# EAGLE design arduino clock divider with logo (EAGLE 9.6.1)
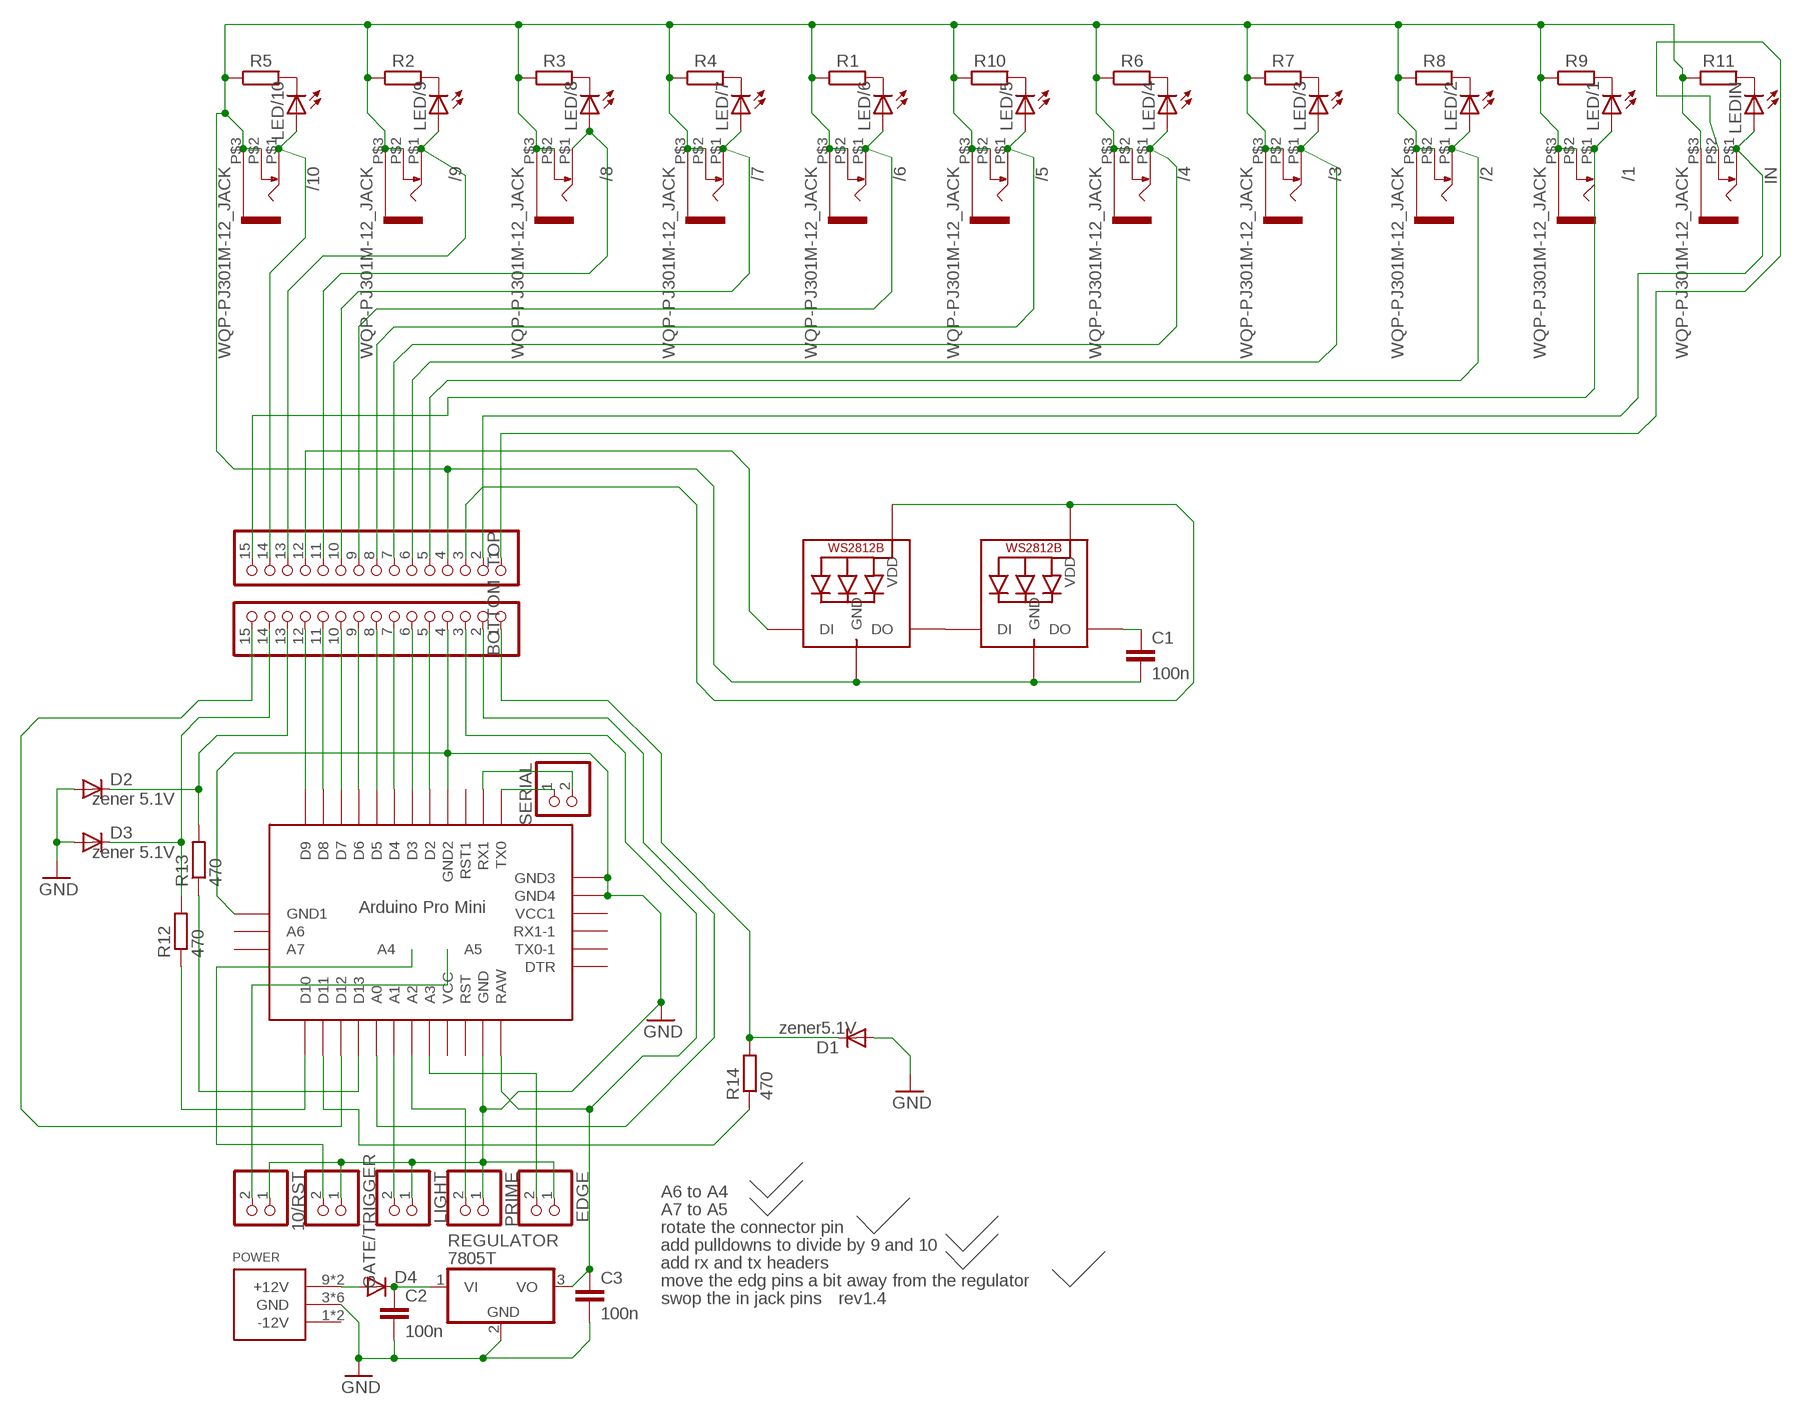
[diagram p0: schematic, sheet 1]

## Parts
10/RST  PINHD-1X2  [1X02]
/1  WQP-PJ301M-12_JACK  [WQP-PJ301M-12_JACK]
/2  WQP-PJ301M-12_JACK  [WQP-PJ301M-12_JACK]
/3  WQP-PJ301M-12_JACK  [WQP-PJ301M-12_JACK]
/4  WQP-PJ301M-12_JACK  [WQP-PJ301M-12_JACK]
/5  WQP-PJ301M-12_JACK  [WQP-PJ301M-12_JACK]
/6  WQP-PJ301M-12_JACK  [WQP-PJ301M-12_JACK]
/7  WQP-PJ301M-12_JACK  [WQP-PJ301M-12_JACK]
/8  WQP-PJ301M-12_JACK  [WQP-PJ301M-12_JACK]
/9  WQP-PJ301M-12_JACK  [WQP-PJ301M-12_JACK]
/10  WQP-PJ301M-12_JACK  [WQP-PJ301M-12_JACK]
BOTTOM  PINHD-1X15-CB  [1X15-CB3D]
C1  100n  C-EU025-025X050  [C025-025X050]
C2  100n  C-EU025-025X050  [C025-025X050]
C3  100n  C-EU025-025X050  [C025-025X050]
D1  zener5.1V  BAV21  [DO35-10]
D2  zener 5.1V  BAV21  [DO35-10]
D3  zener 5.1V  BAV21  [DO35-10]
D4  BAV21  [DO35-10]
EDGE  PINHD-1X2  [1X02]
GATE/TRIGGER  PINHD-1X2  [1X02]
IN  WQP-PJ301M-12_JACK  [WQP-PJ301M-12_JACK]
LED/1  LED3MM  [LED3MM]
LED/2  LED3MM  [LED3MM]
LED/3  LED3MM  [LED3MM]
LED/4  LED3MM  [LED3MM]
LED/5  LED3MM  [LED3MM]
LED/6  LED3MM  [LED3MM]
LED/7  LED3MM  [LED3MM]
LED/8  LED3MM  [LED3MM]
LED/9  LED3MM  [LED3MM]
LED/10  LED3MM  [LED3MM]
LEDIN  LED3MM  [LED3MM]
LIGHT  PINHD-1X2  [1X02]
NEOPIX1  WS2812B5050  [WS2812B]
NEOPIX2  WS2812B5050  [WS2812B]
POWER  POWER_SIMPLE10  [POWER_10]
PRIME  PINHD-1X2  [1X02]
R1  1k  R-EU_0204/2V  [0204V]
R2  1k  R-EU_0204/2V  [0204V]
R3  1k  R-EU_0204/2V  [0204V]
R4  1k  R-EU_0204/2V  [0204V]
R5  1k  R-EU_0204/2V  [0204V]
R6  1k  R-EU_0204/2V  [0204V]
R7  1k  R-EU_0204/2V  [0204V]
R8  1k  R-EU_0204/2V  [0204V]
R9  1k  R-EU_0204/2V  [0204V]
R10  1k  R-EU_0204/2V  [0204V]
R11  330  R-EU_0204/2V  [0204V]
R12  470  R-EU_0204/7  [0204/7]
R13  470  R-EU_0204/7  [0204/7]
R14  470  R-EU_0204/7  [0204/7]
REGULATOR  7805T  [TO220H]
SERIAL  PINHD-1X2  [1X02]
TOP  PINHD-1X15-CB  [1X15-CB3D]
U$1  ABK-PRO-MINI-SMD  [ABK-PRO-MINI-SMD]

## Nets
GND: 10/RST.1 BOTTOM.4 C2.2 C3.2 D1.A D2.A D3.A EDGE.1 GATE/TRIGGER.1 LIGHT.1 POWER.3(GND) POWER.4(GND) POWER.5(GND) POWER.6(GND) POWER.7(GND) POWER.8(GND) PRIME.1 REGULATOR.2(GND) U$1.GND U$1.GND1 U$1.GND2 U$1.GND3 U$1.GND4
N$1: /6.P$1 LED/6.A TOP.9
N$2: LED/6.K(C) R1.2
N$3: BOTTOM.13 D2.C R13.2
N$4: LED/9.K(C) R2.2
N$5: /8.P$1 LED/8.A TOP.11
N$6: LED/8.K(C) R3.2
N$7: /5.P$1 LED/5.A TOP.8
N$8: LED/7.K(C) R4.2
N$9: BOTTOM.14 D3.C R12.2
N$10: LED/10.K(C) R5.2
N$11: /4.P$1 LED/4.A TOP.7
N$12: LED/4.K(C) R6.2
N$13: /3.P$1 LED/3.A TOP.6
N$14: LED/3.K(C) R7.2
N$15: /2.P$1 LED/2.A TOP.5
N$16: LED/2.K(C) R8.2
N$17: D4.A POWER.9(+12V) POWER.10(+12V)
N$18: LED/1.K(C) R9.2
N$19: C2.1 D4.C REGULATOR.1(VI)
N$20: LED/5.K(C) R10.2
N$21: R14.1 U$1.D11
N$22: LEDIN.K(C) R11.2
N$23: IN.P$2 TOP.1
N$24: NEOPIX1.4-DIN(DI) TOP.12
N$25: /7.P$1 LED/7.A TOP.10
N$26: NEOPIX1.2-DOUT(DO) NEOPIX2.4-DIN(DI)
N$27: /10.P$1 LED/10.A TOP.14
N$28: C1.1 NEOPIX2.2-DOUT(DO)
N$29: /9.P$1 LED/9.A TOP.13
N$30: NEOPIX1.1-VDD(VDD) NEOPIX2.1-VDD(VDD) TOP.3
N$31: PRIME.2 U$1.A2
N$32: BOTTOM.3 C3.1 REGULATOR.3(VO) U$1.RAW
N$33: BOTTOM.12 U$1.D9
N$34: BOTTOM.11 U$1.D8
N$35: BOTTOM.10 U$1.D7
N$36: BOTTOM.9 U$1.D6
N$37: BOTTOM.8 U$1.D5
N$38: BOTTOM.7 U$1.D4
N$39: BOTTOM.6 U$1.D3
N$40: BOTTOM.5 U$1.D2
N$41: R13.1 U$1.D13
N$42: R12.1 U$1.D10
N$43: IN.P$1 LEDIN.A TOP.2
N$44: /1.P$1 LED/1.A TOP.15
N$45: BOTTOM.1 D1.C R14.2
N$46: BOTTOM.15 U$1.D12
N$47: LIGHT.2 U$1.A1
N$48: BOTTOM.2 U$1.A0
N$49: EDGE.2 U$1.A3
N$50: 10/RST.2 U$1.A5
N$51: GATE/TRIGGER.2 U$1.A4
N$52: SERIAL.2 U$1.RX1
N$53: SERIAL.1 U$1.TX0
TOPGND: /1.P$2 /1.P$3 /2.P$2 /2.P$3 /3.P$2 /3.P$3 /4.P$2 /4.P$3 /5.P$2 /5.P$3 /6.P$2 /6.P$3 /7.P$2 /7.P$3 /8.P$2 /8.P$3 /9.P$2 /9.P$3 /10.P$2 /10.P$3 C1.2 IN.P$3 NEOPIX1.3-GND(GND) NEOPIX2.3-GND(GND) R1.1 R2.1 R3.1 R4.1 R5.1 R6.1 R7.1 R8.1 R9.1 R10.1 R11.1 TOP.4
Unconnected: POWER.1(-12V) POWER.2(-12V) U$1.A6 U$1.A7 U$1.DTR U$1.RST U$1.RST1 U$1.RX1-1 U$1.TX0-1 U$1.VCC U$1.VCC1

## Notes on the sheet
- A6 to A4
- A7 to A5
- rotate the connector pin
- add pulldowns to divide by 9 and 10
- add rx and tx headers
- move the edg pins a bit away from the regulator
- swop the in jack pins | rev1.4

## Library data of the parts
10/RST EDGE GATE/TRIGGER LIGHT PRIME SERIAL = pinhead:PINHD-1X2: PIN HEADER
/1-/10 IN = thonkiconn:WQP-PJ301M-12_JACK
BOTTOM TOP = adafruit:PINHD-1X15: PIN HEADER
C1-C3 = resistor:C-EU: CAPACITOR, European symbol
D1-D4 = diode:BAV21: DIODE high-voltage general purpose diode
LED/1-LED/10 LEDIN = led:LED: LED OSRAM: - CHIPLED LG R971, LG N971, LY N971, LG Q971, LY Q971, LO R971, LY R971 LH N974, LH R974 LS Q976, LO Q976, LY Q976 LO Q996 - Hyper CHIPLED LW Q18S LB Q993, LB Q99A, LB R99A - SideLED LS A670, LO A670, LY A670, LG A670, LP A670 LB A673, LV A673, LT A673, LW A673 LH A674 LY A675 LS A676, LA A676, LO A676, LY A676, LW A676 LS A679, LY A679, LG A679 - Hyper Micro SIDELED® LS Y876, LA Y876, LO Y876, LY Y876 LT Y87S - SmartLED LW L88C, LW L88S LB L89C, LB L89S, LG L890 LS L89K, LO L89K, LY L89K LS L896, LA L896, LO L896, LY L896 - TOPLED LS T670, LO T670, LY T670, LG T670, LP T670 LSG T670, LSP T670, LSY T670, LOP T670, LYG T670 LG T671, LOG T671, LSG T671 LB T673, LV T673, LT T673, LW T673 LH T674 LS T676, LA T676, LO T676, LY T676, LB T676, LH T676, LSB T676, LW T676 LB T67C, LV T67C, LT T67C, LS T67K, LO T67K, LY T67K, LW E67C LS E67B, LA E67B, LO E67B, LY E67B, LB E67C, LV E67C, LT E67C LW T67C LS T679, LY T679, LG T679 LS T770, LO T770, LY T770, LG T770, LP T770 LB T773, LV T773, LT T773, LW T773 LH T774 LS E675, LA E675, LY E675, LS T675 LS T776, LA T776, LO T776, LY T776, LB T776 LHGB T686 LT T68C, LB T68C - Hyper Mini TOPLED® LB M676 - Mini TOPLED Santana® LG M470 LS M47K, LO M47K, LY M47K Source: http://www.osram.convergy.de LUXEON: - LUMILED® LXK2-PW12-R00, LXK2-PW12-S00, LXK2-PW14-U00, LXK2-PW14-V00 LXK2-PM12-R00, LXK2-PM12-S00, LXK2-PM14-U00 LXK2-PE12-Q00, LXK2-PE12-R00, LXK2-PE12-S00, LXK2-PE14-T00, LXK2-PE14-U00 LXK2-PB12-K00, LXK2-PB12-L00, LXK2-PB12-M00, LXK2-PB14-N00, LXK2-PB14-P00, LXK2-PB14-Q00 LXK2-PR12-L00, LXK2-PR12-M00, LXK2-PR14-Q00, LXK2-PR14-R00 LXK2-PD12-Q00, LXK2-PD12-R00, LXK2-PD12-S00 LXK2-PH12-R00, LXK2-PH12-S00 LXK2-PL12-P00, LXK2-PL12-Q00, LXK2-PL12-R00 Source: www.luxeon.com KINGBRIGHT: KA-3528ASYC Source: www.kingbright.com
NEOPIX1 NEOPIX2 = adafruit:WS2812B
POWER = eurorack:POWER_SIMPLE
R1-R14 = resistor:R-EU_: RESISTOR, European symbol
REGULATOR = adafruit:78*: Positive VOLTAGE REGULATOR Added bigger pads to the TO-92 package
U$1 = Arduino-clone:ABK-PRO-MINI-SMD

## Net classes
0 default: width 0.254 mm, clearance 0.127 mm

## Board
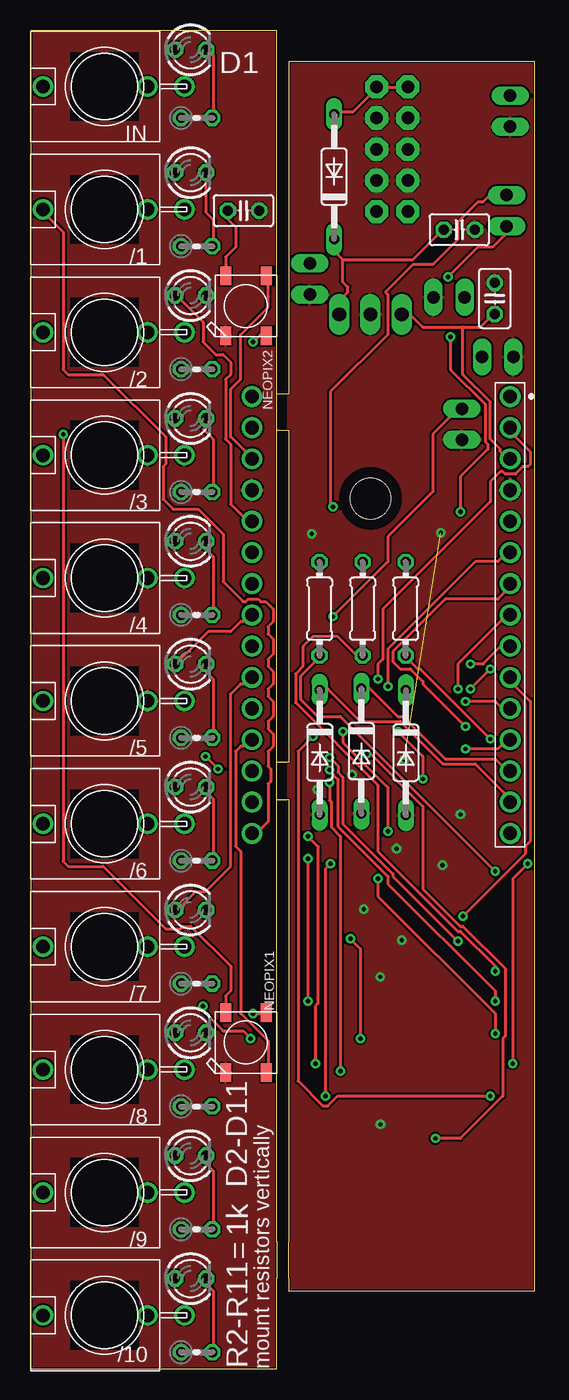
[diagram p1: board, top side]
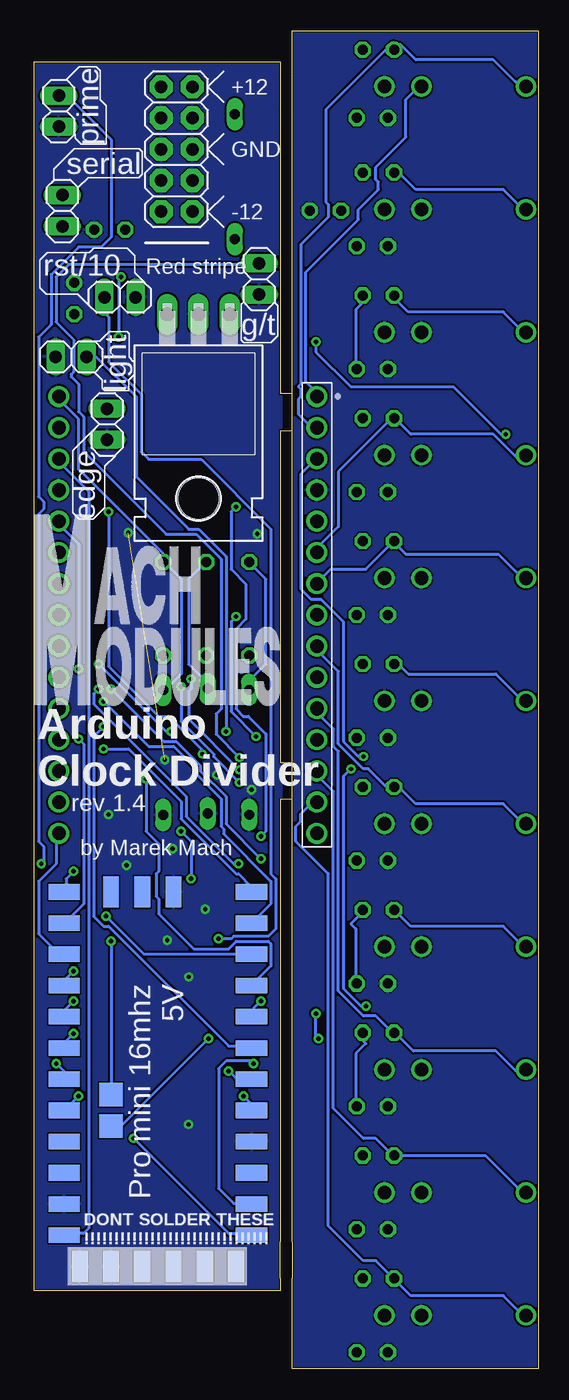
[diagram p2: board, bottom side, seen from below]

Size 41 x 108.89 mm. Coordinates in mm from the lower left corner, seen from the top.
Outline: 20,46.35 20,10.35 20,7.35 20,0 0,0 0,108.89 20,108.89 20,105.35 20,102.35 20,79.35
Outline: 20,49.35 20,76.35
Outline: 20,79.35 21,79.35 21,102.35 21,105.35 21,106.35 41,106.35 41,6.35 21,6.35 21,7.35 21,10.35 21,46.35 20,46.35
Outline: 20,76.35 21,76.35 21,49.35 20,49.35
Outline: 20,46.35 20,49.35
Outline: 20,76.35 20,79.35
Copper layers (1*16): Top 0.035mm / dielectric 0.15mm / Bottom 0.035mm
Design rules "default *": minimum track width 6mil, minimum drill 0.35mm, track to track 6mil, track to pad 6mil, pad to pad 6mil, via to via 6mil, smd to smd 6mil, copper to edge 5mil, drill to drill 6mil, minimum pad ring 10mil, minimum via ring 8mil, stop-mask expansion 4mil, vias tented up to drill 14mil, thermal gap 5mil

### Footprints (pad centres in the part's own frame; a part is rotated, then mirrored left to right if it is on the bottom)
1X02 = drill 1.016 long: 1 -1.27,0; 2 1.27,0
WQP-PJ301M-12_JACK = drill 1.1: P$1 0,5; P$2 0,-3.5; P$3 0,-6.5
1X15-CB3D = drill 1.105 pad 1.705: 1 -17.78,0; 2 -15.24,0; 3 -12.7,0; 4 -10.16,0; 5 -7.62,0; 6 -5.08,0; 7 -2.54,0; 8 0,0; 9 2.54,0; 10 5.08,0; 11 7.62,0; 12 10.16,0; 13 12.7,0; 14 15.24,0; 15 17.78,0
C025-025X050 = drill 0.813 octagon: 1 -1.27,0; 2 1.27,0
DO35-10 = drill 0.813 long: A 5.08,0; C -5.08,0
LED3MM = drill 0.813 octagon: A -1.27,0; K 1.27,0
WS2812B = smd 1.5 x 0.9: 1-VDD 2.45,-1.65; 2-DOUT 2.45,1.65; 3-GND -2.45,1.65; 4-DIN -2.45,-1.65
POWER_10 = drill 1.016 pad 1.88 octagon: 1 -5.08,-1.27; 2 -5.08,1.27; 3 -2.54,-1.27; 4 -2.54,1.27; 5 0,-1.27; 6 0,1.27; 7 2.54,-1.27; 8 2.54,1.27; 9 5.08,-1.27; 10 5.08,1.27
0204V = drill 0.813 octagon: 1 -1.27,0; 2 1.27,0
0204/7 = drill 0.813 octagon: 1 -3.81,0; 2 3.81,0
TO220H = drill 1.118 long: 1 -2.54,-10.16; 2 0,-10.16; 3 2.54,-10.16 | hole 3.302: 0,4.826
ABK-PRO-MINI-SMD = smd 2.54 x 1.27: A0 10.16,-11.43; A1 10.16,-8.89; A2 10.16,-6.35; A3 10.16,-3.81; D2 -5.08,-3.81; D3 -5.08,-6.35; D4 -5.08,-8.89; D5 -5.08,-11.43; D6 -5.08,-13.97; D7 -5.08,-16.51; D8 -5.08,-19.05; D9 -5.08,-21.59; D10 10.16,-21.59; D11 10.16,-19.05; D12 10.16,-16.51; D13 10.16,-13.97; GND 10.16,3.81; GND1 -5.08,-1.27; RAW 10.16,6.35; RST 10.16,1.27; RST1 -5.08,1.27; RX1 -5.08,3.81; TX0 -5.08,6.35; VCC 10.16,-1.27 | smd 1.905 x 1.905: A4 6.35,-5.08; A5 6.35,-2.54 | smd 1.27 x 2.54: A6 3.81,-21.59; A7 6.35,-21.59; DTR -3.81,8.89; GND2 8.89,8.89; GND3 6.35,8.89; GND4 1.27,-21.59; RX1-1 1.27,8.89; TX0-1 -1.27,8.89; VCC1 3.81,8.89

### Placement (x,y rotation side)
10/RST  34.02,87.21 180 bottom
/1  6,94.35 90 top
/2  6,84.35 90 top
/3  6,74.35 90 top
/4  6,64.35 90 top
/5  6,54.35 90 top
/6  6,44.35 90 top
/7  6,34.35 90 top
/8  6,24.35 90 top
/9  6,14.35 90 top
/10  6,4.35 90 top
BOTTOM  39,61.35 270 top
C1  17.31,94.25 0 top
C2  34.87,92.7 0 top
C3  37.75,87.1 90 top
D1  30.51,50.14 270 top
D2  26.89,50.27 270 top
D3  23.51,50.17 270 top
D4  24.68,97.01 90 top
EDGE  35.07,76.87 90 bottom
GATE/TRIGGER  22.7,88.69 90 bottom
IN  6,104.35 90 top
LED/1  13,97.35 0 top
LED/2  13,87.35 0 top
LED/3  13,77.35 0 top
LED/4  13,67.35 0 top
LED/5  13,57.35 0 top
LED/6  13,47.35 0 top
LED/7  13,37.35 0 top
LED/8  13,27.35 0 top
LED/9  13,17.35 0 top
LED/10  13,7.35 0 top
LEDIN  13,107.35 0 top
LIGHT  38,82.35 0 bottom
NEOPIX1  17.5,26.55 90 top
NEOPIX2  17.5,86.49 90 top
POWER  29.41,99.25 90 bottom
PRIME  39,102.35 90 bottom
R1  13.5,41.35 0 top
R2  13.5,11.35 0 top
R3  13.5,21.35 0 top
R4  13.5,31.35 0 top
R5  13.5,1.35 0 top
R6  13.5,61.35 0 top
R7  13.5,71.35 0 top
R8  13.5,81.35 0 top
R9  13.5,91.35 0 top
R10  13.5,51.35 0 top
R11  13.5,101.8 0 top
R12  23.5,61.85 90 top
R13  27,61.85 90 top
R14  30.5,61.85 90 top
REGULATOR  27.64,75.65 180 bottom
SERIAL  38.72,94.24 90 bottom
TOP  18,61.35 270 bottom
U$1  28.4,17.22 180 bottom

### Tracks (layer width: path | path; a pad name or v marks a point on that pad's centre or on a via)
GND  (via drill 0.35)  (1 unrouted)
  other vias: 29.74,42.33 27.09,37.39 28.44,31.89 23.31,47.12 30.39,49.57 33.49,40.97 34.97,45.11 30.18,34.88 26.13,48.34 28.45,19.89 33.35,68.02 22.86,67.94
  pour Top: 40.96,6.35 40.96,106.36 20.95,106.36 20.95,6.35
  pour Bottom: 20.95,6.35 40.96,6.35 40.96,106.36 20.95,106.36
N$1
  Bottom 0.254: /6.P$1 1.02,44.55 1.42,44.55 2.85,45.97 9.96,45.97 11.18,47.19 11.58,47.19 LED/6.A 11.79,47.4 12.39,47.4 13.82,48.82 14.22,48.82 16.26,50.85 16.26,56.74 17.88,58.37 17.88,58.78 TOP.9
N$2
  Top 0.254: R1.2 14.83,41.5 14.83,46.38 14.43,46.79 14.43,47.19 LED/6.K
N$3
  Top 0.254: BOTTOM.13 38.81,48.82 38.61,48.82 37.8,49.63 33.73,49.63 30.28,53.09 29.87,53.09 27.43,55.52 27.03,55.52 D2.C
  Bottom 0.254: D2.C 27.03,55.52 27.03,55.93 28.45,57.35 28.45,64.26 27.03,65.68 R13.2
N$4
  Top 0.254: R2.2 14.83,11.43 14.83,16.1 14.22,16.71 14.22,17.32 LED/9.K
N$5
  Bottom 0.254: /8.P$1 1.02,24.23 1.83,24.23 3.45,25.86 10.16,25.86 11.58,27.28 LED/8.A 11.79,27.28 13.21,28.7 14.22,28.7 16.26,30.73 16.26,50.24 16.66,50.65 16.66,52.07 17.88,53.29 17.88,53.7 TOP.11
N$6
  Bottom 0.254: R3.2 14.83,21.39 14.83,25.65 14.02,26.47 14.22,26.67 14.22,27.28 LED/8.K
N$7
  Top 0.254: LED/5.A 11.79,57.35 14.43,60 16.26,60 17.07,60.81 17.27,60.81 17.88,61.42 TOP.8
  Bottom 0.254: /5.P$1 1.02,54.51 1.42,54.51 3.45,56.54 10.57,56.54 11.18,57.15 11.58,57.15 LED/5.A
N$8
  Bottom 0.254: R4.2 14.83,31.55 14.83,35.81 15.24,36.22 14.22,37.24 LED/7.K
N$9
  Top 0.254: BOTTOM.14 38.81,46.18 38.81,46.58 36.17,49.23 33.53,49.23 30.07,52.68 26.82,52.68 24.18,55.32 23.57,55.32 D3.C
  Bottom 0.254: R12.2 23.37,65.48 22.15,64.26 22.15,57.35 23.37,56.13 23.37,55.32 D3.C
N$10
  Top 0.254: R5.2 14.83,1.47 14.83,6.35 14.43,6.76 14.43,7.16 LED/10.K
N$11
  Bottom 0.254: 11.79,67.31 14.02,65.08 16.87,65.08 17.88,64.06 TOP.7 | 11.79,67.31 10.77,66.29 3.25,66.29 1.42,64.47 1.02,64.47 /4.P$1 | 11.79,67.31 LED/4.A
N$12
  Top 0.254: R6.2 14.83,61.42 14.83,66.09 14.22,66.7 14.22,67.31 LED/4.K
N$13
  Bottom 0.254: /3.P$1 1.02,74.22 1.83,74.22 3.66,76.05 10.36,76.05 11.58,77.27 LED/3.A 11.79,77.47 16.26,73 16.26,68.53 17.88,66.9 17.88,66.5 TOP.6
N$14
  Top 0.254: R7.2 14.83,71.37 14.83,75.64 14.02,76.45 14.22,76.66 14.22,77.27 LED/3.K
N$15
  Top 0.254: TOP.5 17.88,69.14 17.48,69.14 16.26,70.36 16.26,75.23 15.85,75.64 15.85,80.52 16.26,80.92 16.26,81.94 15.65,82.55 15.04,82.55 14.02,83.57 14.02,85.19 11.79,87.43 LED/2.A
  Bottom 0.254: LED/2.A 11.58,87.22 11.58,87.02 10.57,86 2.85,86 1.02,84.18 /2.P$1
N$16
  Bottom 0.254: R8.2 14.83,81.53 14.83,86.21 14.43,86.61 14.43,87.22 LED/2.K
N$17
  Top 0.254: 28.25,104.29 26.21,102.26 24.79,102.26 D4.A | 28.25,104.29 30.48,104.29 POWER.10 | 28.25,104.29 POWER.9
N$18
  Top 0.254: R9.2 14.83,91.49 14.83,93.52 14.22,94.13 14.22,97.18 LED/1.K
N$19
  Top 0.254: 25.4,90.27 24.79,90.88 24.79,91.9 D4.C | 25.4,90.27 25.4,88.44 25.81,88.04 25.81,87.63 25.2,87.02 25.2,86 REGULATOR.1 | 25.4,90.27 31.09,90.27 33.33,92.51 33.53,92.51 C2.1
N$20
  Top 0.254: R10.2 14.83,51.46 14.83,56.13 14.22,56.74 14.22,57.15 LED/5.K
N$21  (via drill 0.35)
  Top 0.254: v37.39,51.26 31.7,56.95 31.5,56.95 30.48,57.96 R14.1
  Bottom 0.254: v37.39,51.26 36.98,50.85 36.98,37.85 38.41,36.42 U$1.D11
N$22
  Top 0.254: R11.2 14.83,101.85 14.83,106.93 14.43,107.34 14.43,107.75 LEDIN.K
N$23
  Bottom 0.254: IN.P$2 9.55,104.7 9.55,104.5 10.77,103.28 10.77,100.23 13.21,97.79 13.21,96.77 13.01,96.57 13.01,95.96 14.63,94.34 14.63,93.52 18.9,89.26 18.9,80.31 17.88,79.3 TOP.1
N$24
  Top 0.254: NEOPIX1.4-DIN 19.3,24.23 19.3,26.67 17.07,28.91 17.07,42.11 16.66,42.52 16.66,50.24 17.07,50.65 17.27,50.65 17.88,51.26 TOP.12
N$25
  Top 0.254: TOP.10 17.88,56.13 17.68,56.13 17.27,55.73 17.07,55.73 16.26,54.91 16.26,40.89 14.22,38.86 13.41,38.86 11.79,37.24 LED/7.A
  Bottom 0.254: LED/7.A 11.58,37.24 10.36,36.02 2.85,36.02 1.02,34.19 /7.P$1
N$26  (via drill 0.35)
  Top 0.254: v2.64,76.05 2.64,41.3 3.05,40.89 5.89,40.89 10.97,35.81 12.19,35.81 12.39,36.02 13.01,36.02 16.26,32.77 16.26,30.73 15.85,30.33 15.85,29.11 NEOPIX1.2-DOUT | v18.09,83.57 18.69,84.18 19.1,84.18 NEOPIX2.4-DIN
  Bottom 0.254: v2.64,76.05 3.05,76.05 6.91,79.91 15.24,79.91 18.09,82.75 v18.09,83.57
N$27
  Bottom 0.254: /10.P$1 1.02,4.52 1.42,4.52 2.85,5.94 10.36,5.94 11.58,7.16 LED/10.A 11.79,7.37 13.21,8.79 14.22,8.79 17.07,11.63 17.07,40.28 19.71,42.93 19.71,44.15 19.3,44.55 19.3,45.16 18.49,45.97 18.09,45.97 TOP.14
N$28
  Top 0.254: NEOPIX2.2-DOUT 15.85,89.05 15.85,90.47 16.66,91.29 16.66,92.91 16.05,93.52 16.05,94.13 C1.1
N$29
  Bottom 0.254: /9.P$1 1.02,14.48 1.42,14.48 4.27,17.32 11.58,17.32 LED/9.A 11.79,17.32 13.21,18.74 14.22,18.74 16.66,21.18 16.66,46.99 17.88,48.21 17.88,48.62 TOP.13
N$30  (via drill 0.35)
  Top 0.254: 19.3,29.11 NEOPIX1.1-VDD 19.1,28.91 v18.09,28.91 | NEOPIX2.1-VDD 19.3,88.85 19.3,86.41 17.07,84.18 17.07,80.52 16.26,79.7 16.26,75.84 17.88,74.22 TOP.3 | v17.88,26.87 17.27,27.48 15.65,27.48 14.02,29.11 v14.02,29.52 | v14.22,49.84 v15.24,48.82
  Bottom 0.254: 17.88,74.22 TOP.3 18.09,74.02 19.3,72.8 19.3,63.45 18.49,62.64 17.68,62.64 15.85,60.81 15.85,51.05 14.63,49.84 v14.22,49.84 | v18.09,28.91 18.09,27.08 v17.88,26.87 | v14.02,29.52 14.43,29.52 15.85,30.94 15.85,48.21 v15.24,48.82
N$31  (via drill 0.35)
  Top 0.254: v39.22,24.84 39.22,39.88 v40.44,41.1
  Bottom 0.254: v39.22,24.84 38.61,24.23 38.61,23.62 U$1.A2 | v40.44,41.1 40.23,41.3 40.23,42.52 40.64,42.93 40.64,69.55 40.23,69.95 40.23,70.56 40.64,70.97 40.64,83.97 39.62,84.99 39.62,89.05 37.39,91.29 35.56,91.29 34.75,92.1 34.75,100.02 38.2,103.48 38.81,103.48 PRIME.2
N$32
  Top 0.254: 35.15,84.78 31.9,84.78 30.89,85.8 30.28,85.8 REGULATOR.3 | 35.15,84.78 36.58,84.78 37.59,85.8 C3.1 | 35.15,84.78 35.15,80.92 37.39,78.69 37.39,75.64 38.2,74.83 38.2,74.62 38.81,74.02 BOTTOM.3
  Bottom 0.254: U$1.RAW 38.41,11.02 36.98,11.02 36.58,11.43 36.58,71.37 38.81,73.61 38.81,74.02 BOTTOM.3
N$33  (via drill 0.35)
  Top 0.254: v35.36,50.44 38,50.44 38.81,51.26 BOTTOM.12
  Bottom 0.254: v35.36,50.44 33.33,50.44 29.06,46.18 29.06,44.76 24.59,40.28 24.38,40.28 23.37,39.27 23.37,38.86 U$1.D9
N$34  (via drill 0.35)
  Top 0.254: v35.36,54.3 37.8,54.3 38.2,53.9 38.81,53.9 BOTTOM.11
  Bottom 0.254: v35.36,54.3 31.7,50.65 29.67,50.65 27.94,48.92 27.94,48.52 25.81,46.39 25.81,44.15 25.6,43.94 25.6,43.54 21.74,39.68 21.74,37.85 23.16,36.42 U$1.D8
N$35  (via drill 0.35)
  Top 0.254: v35.15,36.83 40.23,41.91 40.23,42.52 40.64,42.93 40.64,54.3 38.81,56.13 BOTTOM.10
  Bottom 0.254: v35.15,36.83 32.11,33.78 23.37,33.78 U$1.D7
N$36  (via drill 0.35)
  Top 0.254: v31.9,48.01 31.9,49.84 v29.87,51.87 | v35.76,57.35 36.78,57.35 38.2,58.78 38.81,58.78 BOTTOM.9
  Bottom 0.254: v31.9,48.01 31.9,43.74 30.89,42.72 30.89,40.49 31.09,40.28 31.09,38.46 30.89,38.25 30.89,37.03 28.04,34.19 25.2,34.19 24.59,34.8 21.95,34.8 21.74,34.59 21.74,32.77 23.16,31.34 U$1.D6 | v29.87,51.87 30.28,51.87 v35.76,57.35
N$37  (via drill 0.35)
  Top 0.254: v22.55,41.5 v22.55,29.92 | v34.75,55.32 34.75,57.35 38.81,61.42 BOTTOM.8
  Bottom 0.254: v22.55,29.92 23.16,29.31 23.16,28.7 U$1.D5 | v22.55,41.5 25.4,44.35 25.4,46.56 27.49,48.65 27.49,49.08 29.46,51.05 30.48,51.05 v34.75,55.32
N$38  (via drill 0.35)
  Top 0.254: v35.36,52.27 31.9,55.73 31.9,55.93 30.89,56.95 30.07,56.95 29.46,57.56 29.46,58.37 33.73,62.64 38,62.64 38.81,63.45 38.81,63.86 BOTTOM.7
  Bottom 0.254: v35.36,52.27 36.17,51.46 36.17,36.83 35.36,36.02 34.95,36.02 25.2,26.26 23.37,26.26 U$1.D4
N$39  (via drill 0.35)
  Top 0.254: v25.2,24.23 25.2,43.33 24.45,44.08 24.45,46.14 24.31,46.28 v24.31,47.72 | v29.06,55.52 29.06,58.57 36.17,65.68 38,65.68 38.81,66.5 BOTTOM.6
  Bottom 0.254: v25.2,24.23 24.59,23.62 23.37,23.62 U$1.D3 | v24.31,47.72 26.42,49.83 26.42,50.04 29.06,52.68 v29.06,55.52
N$40  (via drill 0.35)
  Top 0.254: v23.98,22.2 23.98,40.69 v24.38,41.1 | v37.39,56.95 v35.76,55.32
  Bottom 0.254: v23.98,22.2 23.37,21.59 23.37,21.18 U$1.D2 | v24.38,41.1 24.79,41.1 28.65,44.96 28.65,46.58 36.17,54.1 36.17,54.91 v35.76,55.32 | v37.39,56.95 37.39,67.11 38.81,68.53 38.81,68.94 BOTTOM.5
N$41  (via drill 0.35)
  Top 0.254: v37.8,32.36 37.8,32.77 34.95,35.61 34.75,35.61 28.25,42.11 28.25,47.51 21.54,54.21 21.54,56.54 22.15,57.15 22.15,58.78 22.96,59.59 24.99,59.59 26.42,58.17 26.82,58.17 R13.1
  Bottom 0.254: v37.8,32.36 38.41,31.75 38.41,31.34 U$1.D13
N$42  (via drill 0.35)
  Top 0.254: v37.8,40.49 25.2,53.09 23.36,53.09 21.95,54.51 21.95,56.34 23.57,57.96 R12.1
  Bottom 0.254: v37.8,40.49 38.41,39.88 38.41,38.86 U$1.D10
N$43
  Bottom 0.254: IN.P$1 1.02,104.7 1.83,104.7 3.66,106.53 9.96,106.53 11.18,107.75 11.58,107.75 LEDIN.A 11.79,107.95 17.27,102.46 17.27,94.94 17.07,94.74 17.07,93.73 19.3,91.49 19.3,80.11 19.51,79.91 19.3,79.7 19.3,79.1 19.51,78.89 19.51,77.67 18.49,76.66 18.09,76.66 TOP.2
N$44
  Top 0.254: TOP.15 18.09,43.74 18.49,43.74 19.3,44.55 19.3,47.6 19.51,47.8 19.51,48.82 19.3,49.02 19.3,50.24 19.71,50.65 19.71,51.66 19.3,52.07 19.3,52.68 19.71,53.09 19.71,54.3 19.3,54.71 19.3,55.32 19.71,55.73 19.71,56.74 19.3,57.15 19.3,57.76 19.71,58.17 19.71,59.38 19.3,59.79 19.3,60.4 19.71,60.81 19.71,61.82 19.1,62.43 18.69,62.43 18.49,62.64 17.68,62.64 17.48,62.43 17.27,62.43 15.65,64.06 15.65,67.92 13.61,69.95 11.58,69.95 10.77,70.76 10.77,73.41 10.97,73.61 10.97,75.84 5.89,80.92 3.05,80.92 2.64,81.33 2.64,92.51 0.81,94.34 /1.P$1
  Bottom 0.254: LED/1.A 11.58,97.18 11.18,97.18 9.96,95.96 2.85,95.96 1.42,94.54 1.02,94.54 /1.P$1
N$45
  Bottom 0.254: 30.48,65.68 29.06,64.26 29.06,56.54 29.87,55.73 30.07,55.73 30.48,55.32 D1.C | 30.48,65.68 30.48,66.29 37.39,73.2 37.39,77.27 38.81,78.69 38.81,79.1 BOTTOM.1 | 30.48,65.68 R14.2
N$46
  Bottom 0.254: U$1.D12 38.61,33.78 39.01,33.78 40.64,35.41 40.64,39.68 39.22,41.1 39.22,43.33 39.01,43.54 BOTTOM.15
N$47  (via drill 0.35)
  Top 0.254: v37.8,27.28 37.8,28.91 28.25,38.46 v28.25,39.88 | v29.06,43.74 29.06,47.32 25.4,50.98 v25.4,51.87
  Bottom 0.254: v37.8,27.28 38.41,26.67 38.41,26.26 U$1.A1 | v28.25,39.88 28.25,42.93 v29.06,43.74 | v25.4,51.87 25.4,66.09 27.64,68.33 28.45,68.33 32.72,72.59 32.72,79.1 35.97,82.35 36.58,82.35 LIGHT.2
N$48  (via drill 0.35)
  Top 0.254: v37.8,29.92 37.8,30.73 29.06,39.47 29.06,40.08 24.99,44.15 24.99,47.97 24.31,48.65 v24.31,48.74 | v28.25,56.13 28.25,57.35 28.65,57.76 28.65,61.82 37.39,70.56 37.39,72.19 38.2,73 38.41,73 38.61,72.8 39.42,72.8 40.03,73.41 40.44,73.41 40.64,73.61 40.64,74.62 38.81,76.45 BOTTOM.2
  Bottom 0.254: v37.8,29.92 38.41,29.31 38.41,28.7 U$1.A0 | v24.31,48.74 28.45,52.88 28.45,55.12 28.25,55.32 v28.25,56.13
N$49  (via drill 0.35)
  Top 0.254: v37.39,22.2 24.99,22.2 24.18,21.39 23.77,21.39 21.74,23.42 21.74,50.24 v22.96,51.46 | v24.59,61.21 29.06,65.68 29.06,67.72 32.72,71.37 32.72,76.05 34.95,78.28 EDGE.2
  Bottom 0.254: v37.39,22.2 38.41,21.18 U$1.A3 | v22.96,51.46 24.99,53.49 24.99,60.81 v24.59,61.21
N$50  (via drill 0.35)
  Top 0.254: v26.82,26.87 26.82,34.19 v26.01,35
  Bottom 0.254: v26.82,26.87 33.93,19.76 U$1.A5 | v26.01,35 24.99,35 24.79,35.2 21.95,35.2 21.34,35.81 21.34,39.88 21.74,40.28 21.74,68.33 27.43,74.02 31.7,74.02 32.31,74.62 32.31,79.3 34.95,81.94 34.95,85.6 35.15,85.8 35.15,87.02 10/RST.2
N$51  (via drill 0.35)
  Top 0.254: v34.75,34.8 29.46,40.08 29.46,40.28 25.4,44.35 25.4,48.13 25,48.53 25,49.06 v24.31,49.75
  Bottom 0.254: v34.75,34.8 34.75,22.4 U$1.A4 | v24.31,49.75 26.21,51.66 26.21,53.29 25.81,53.7 25.81,65.89 27.84,67.92 30.28,67.92 36.98,74.62 36.98,77.47 37.39,77.88 37.39,80.11 38,80.72 38,80.92 37.8,81.13 37.8,83.77 39.22,85.19 39.22,88.85 38.2,89.86 22.76,89.86 GATE/TRIGGER.2
N$52  (via drill 0.35)
  Top 0.254: v23.16,24.84 23.16,29.52 23.37,29.72 23.37,42.52 v22.55,43.33 | v24.59,70.16 24.38,70.36 24.38,79.5 29.06,84.18 29.06,87.43 28.85,87.63 31.09,89.86 32.72,89.86 34.75,91.9 34.75,93.32 36.37,94.94 36.78,94.94 37.35,95.51 SERIAL.2
  Bottom 0.254: v23.16,24.84 23.37,25.04 25.4,25.04 26.01,24.44 26.01,14.68 24.79,13.46 23.37,13.46 U$1.RX1 | v22.55,43.33 22.15,43.74 22.15,51.66 23.57,53.09 23.98,53.09 24.59,53.7 24.59,60.2 23.77,61.01 23.77,63.86 24.99,65.08 24.99,69.75 v24.59,70.16
N$53  (via drill 0.35)
  Top 0.254: v32.92,18.74 34.95,18.74 38.41,22.2 38.41,26.87 38.61,27.08 38.61,32.56 35.15,36.02 34.95,36.02 31.9,39.07 31.9,45.77 27.65,50.02 v27.33,50.02 | v34.95,69.75 34.95,72.59 37.19,74.83 37.19,75.23 36.98,75.44 36.98,78.49 34.14,81.33 v34.14,83.97 | v33.93,88.85 36.37,91.29 37.59,91.29 38.61,92.3 38.61,92.86 SERIAL.1
  Bottom 0.254: v32.92,18.74 25.2,11.02 23.37,11.02 U$1.TX0 | v27.33,50.02 27.33,50.34 30.07,53.09 30.89,53.09 34.95,57.15 v34.95,69.75 | v34.14,83.97 34.14,88.65 v33.93,88.85
TOPGND
  pour Bottom: 0,0 20,0 20,108.9 0,108.9
  pour Top: 0,0 20,0 20,108.9 0,108.9

### Text on the board
tNames: D1 | D2-D11 | 1k | = | R2-R11 | mount resistors vertically
bNames: prime | serial | rst/10 | g/t | light | edge | Arduino / Clock Divider | rev 1.4 | by Marek Mach | Pro mini 16mhz / 5V | DONT SOLDER THESE / !!!!!!!!!!!!!!!!!!!!!!!!!!!!!!!